# Altium project PCB_Soldeerstation.PrjPcb
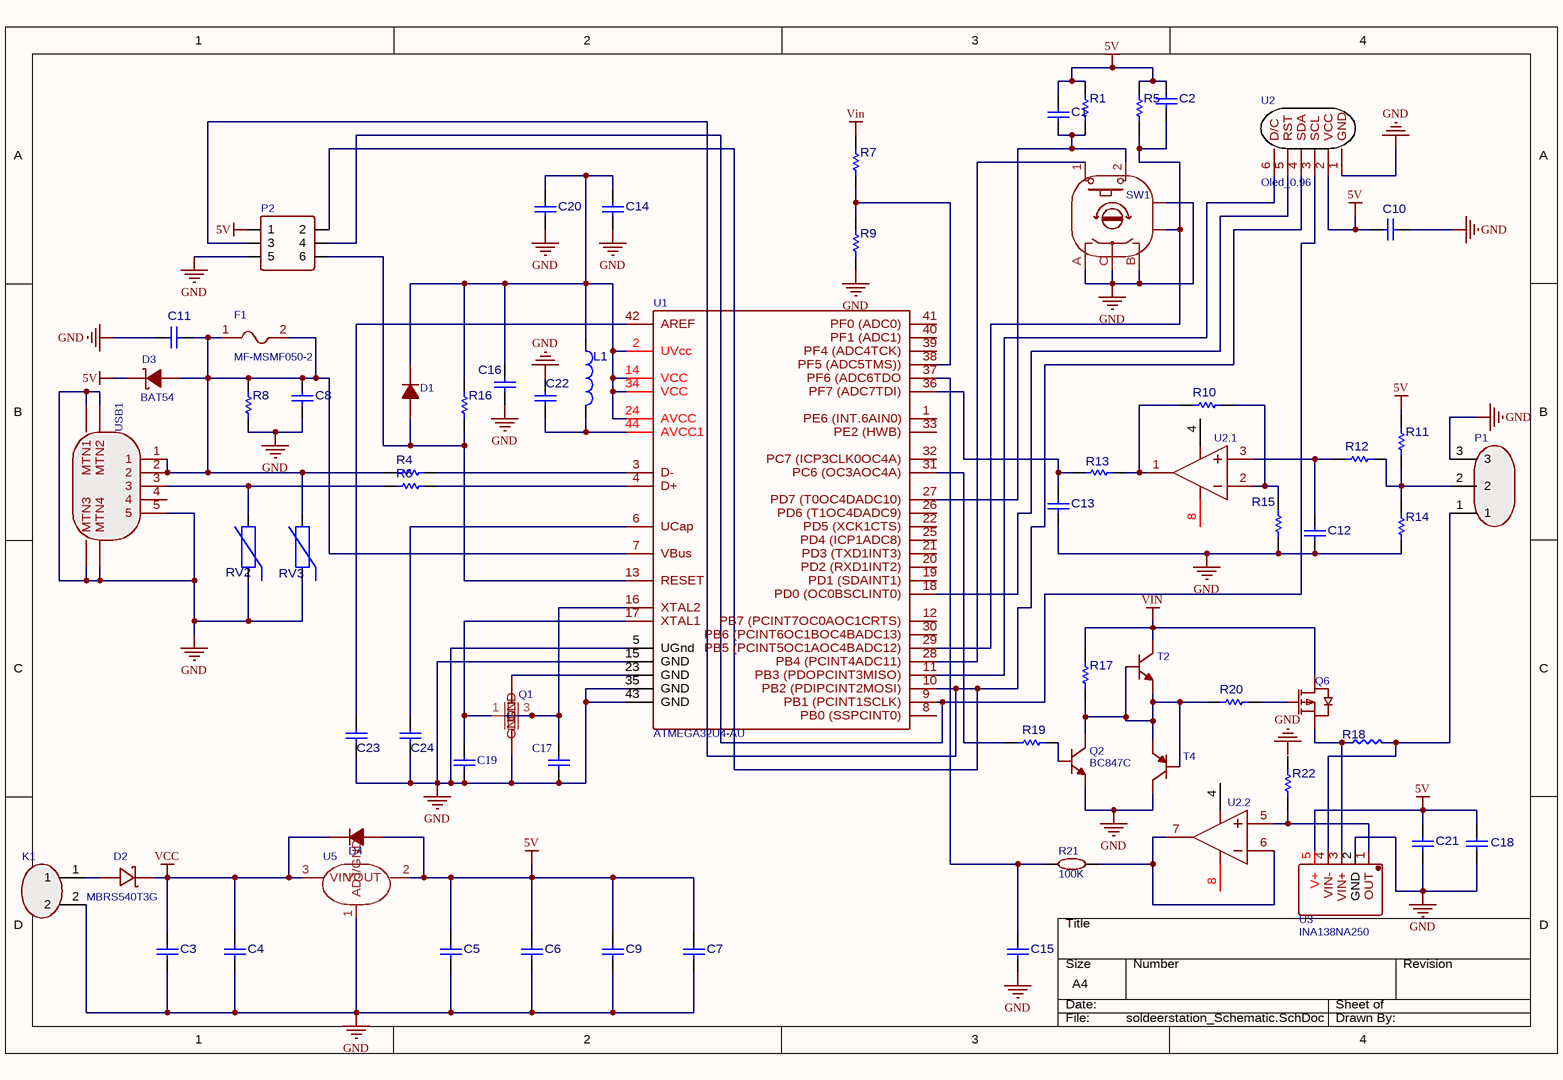
[diagram p0: soldeerstation_Schematic.SchDoc]
1 sheet, 68 parts. Net scope: global (net labels, ports and power ports of the same name join across sheets).
Board file: PCB1.PcbDoc

## Sheet soldeerstation_Schematic.SchDoc: Soldeerstation
size A4; Engineer: Oguzhan Guney

### Parts
*  R18  [r18]
C1  GRM188R71H103KA01D  [CAPC1608X90X35ML10T15]  (value not drawn)
C2  GRM188R71H103KA01D  [CAPC1608X90X35ML10T15]  (value not drawn)
C3  CL31B106KLHNNNE  [CAPC3216X180X50LL20T30]  (value not drawn)
C4  C0402C104K8PACTU  [CAPC1005X60X30ML05T10]  (value not drawn)
C5  C0402C104K8PACTU  [CAPC1005X60X30ML05T10]  (value not drawn)
C6  CAP 47uF 10V 1206(3216)  [CAPC1206(3216)190_N]  (value not drawn)
C7  C1206C106K8RACTU  [CAPC3216X180X50LL20T25]  (value not drawn)
C8  C0402C104K8PACTU  [CAPC1005X60X30ML05T10]  (value not drawn)
C9  C0402C104K8PACTU  [CAPC1005X60X30ML05T10]  (value not drawn)
C10  C0402C104K8PACTU  [CAPC1005X60X30ML05T10]  (value not drawn)
C11  GRM219R61A226MEA0D  [CAPC2013X95X45ML15T25]  (value not drawn)
C12  GRM188R71H103KA01D  [CAPC1608X90X35ML10T15]  (value not drawn)
C13  GRM188R71H103KA01D  [CAPC1608X90X35ML10T15]  (value not drawn)
C14  C0402C104K8PACTU  [CAPC1005X60X30ML05T10]  (value not drawn)
C15  12061C105KAT2A  [CAPC3216X180X50LL20T25]  (value not drawn)
C16  C0402C104K8PACTU  [CAPC1005X60X30ML05T10]  (value not drawn)
C17  CAP 22pF 50V 0805(2012)  [CAPC0805(2012)100_L]  (value not drawn)
C18  C1206C106K8RACTU  [CAPC3216X180X50LL20T25]  (value not drawn)
C19  CAP 22pF 50V 0805(2012)  [CAPC0805(2012)100_L]  (value not drawn)
C20  C1206C106K8RACTU  [CAPC3216X180X50LL20T25]  (value not drawn)
C21  C0402C104K8PACTU  [CAPC1005X60X30ML05T10]  (value not drawn)
C22  12061C105KAT2A  [CAPC3216X180X50LL20T25]  (value not drawn)
C23  C0402C104K8PACTU  [CAPC1005X60X30ML05T10]  (value not drawn)
C24  12061C105KAT2A  [CAPC3216X180X50LL20T25]  (value not drawn)
D1  CD1206-S01575  [D-1206]  (value not drawn)
D2  MBRS540T3G  [SMC]
D3  BAT54  [SOT-23(SOT-23-3)]
D4  S1A  [SMA(DO-214AC)]  (value not drawn)
F1  MF-MSMF050-2  [1812]
K1  WJ25C-B-2P  [WJ25C-B-7.62-2P]  (value not drawn)
L1  74279206  [SMD-0805]  (value not drawn)
P1  WJ25C-B-7.62-3P-13-00A  [WJ25C-B-7.62-3P]  (value not drawn)
P2  Header-Male-2.54_2x3  [HDR-3X2/2.54]  (value not drawn)
Q1  KX-7  [KX-7]  (value not drawn)
Q2  BC847C  [SOT-23(SOT-23-3)]
Q6  IRF9540NPBF  [TO-220(TO-220-3)]  (value not drawn)
R1  RC0603FR-0710KL  [RESC1608X55X25ML10T15]  (value not drawn)
R4  ERJ-2RKF22R0X  [RESC1005X40X25ML05T05]  (value not drawn)
R5  RC0603FR-0710KL  [RESC1608X55X25ML10T15]  (value not drawn)
R6  ERJ-2RKF22R0X  [RESC1005X40X25ML05T05]  (value not drawn)
R7  RC0603FR-0710KL  [RESC1608X55X25ML10T15]  (value not drawn)
R8  RC0603FR-0710KL  [RESC1608X55X25ML10T15]  (value not drawn)
R9  ERJ2RKF2701X  [RESC1005X40X25NL05T05]  (value not drawn)
R10  ERJ2RKF1802X  [RESC1005X40X25NL05T05]  (value not drawn)
R11  ERJ-2RKF1004X  [RESC1005X40X25LL05T05]  (value not drawn)
R12  ERJ2RKF5601X  [RESC1005X40X25LL05T05]  (value not drawn)
R13  ERJ2RKF5601X  [RESC1005X40X25LL05T05]  (value not drawn)
R14  CRCW060310M0FKEA  [RESC1609X50X30ML10T20]  (value not drawn)
R15  91R 1% 0603(1608)  [RESC0603(1608)_L]  (value not drawn)
R16  RC0603FR-0710KL  [RESC1608X55X25ML10T15]  (value not drawn)
R17  ERJ-3EKF4701V  [RESC1608X55X30NL15T15]  (value not drawn)
R19  RC0603FR-0710KL  [RESC1608X55X25ML10T15]  (value not drawn)
R20  91R 1% 0603(1608)  [RESC0603(1608)_L]  (value not drawn)
R21  100K  [0805]
R22  ERJ2RKF5603X  [RESC1005X40X25NL05T05]  (value not drawn)
RV2  CG0603MLC-05E  [BOUR-CG0603-2_V]  (value not drawn)
RV3  CG0603MLC-05E  [BOUR-CG0603-2_V]  (value not drawn)
SW1  PEC11R-4015F-S0024  [BOURNS_PEC11R-4XXXF-SXXXX]  (value not drawn)
T2  BC847C  [SOT-23(SOT-23-3)]  (value not drawn)
T4  BC857C  [SOT-23(SOT-23-3)]  (value not drawn)
U1  ATMEGA32U4-AU  [QFP-44_10X10X08P]
U2  Oled_0.96  [OLED_0.96'']
U2.1  MCP6002T-E/SN  [SOIC-8_150MIL]  (value not drawn)
U2.2  MCP6002T-E/SN  [SOIC-8_150MIL]  (value not drawn)
U3  INA138NA250  [SOT-23-5]
U5  NCP1117ST50T3G  [SOT-223]  (value not drawn)
USB1  micro USB_B Female  [MICRO-USB-1]  (value not drawn)

### Nets
5V: C1.2 C2.2 C5.2 C6.2 C7.2 C9.2 C10.2 C18.2 C21.2 D3.3(K) D4.1(A) P2.1 R1.2 R5.2 R11.2 U2.2(VCC) U3.5(V+) U5.2(VOUT)
GND: C3.1 C4.1 C5.1 C6.1 C7.1 C8.1 C9.1 C10.1 C11.1 C12.1 C13.1 C14.1 C15.1 C16.1 C17.1 C18.1 C19.1 C20.1 C21.1 C22.2 C23.1 C24.1 K1.2 P1.3 P2.5 Q1.2(GND) Q2.2(E) R8.1 R9.1 R14.1 R15.2 RV2.1 RV3.1 SW1.A SW1.B SW1.C SW1.MT2 T4.3(C) U1.5(UGnd) U1.15(GND) U1.35(GND) U1.43(GND) U2.1(GND) U3.2(GND) U5.1(ADJ/GND) USB1.0(MTN4) USB1.5
VCC: C3.2 C4.2 D2.C D4.2(K) U5.3(VIN)
Vin: Q6.2(D) R7.2 R17.2 T2.3(C)
Net*_2: *.2 Q6.3(S) U3.3(VIN+)
Net*_3: *.3 P1.1 U3.4(VIN-)
NetC1_1: C1.1 R1.1 SW1.2 U1.27(PD7_(T0OC4DADC10))
NetC2_1: C2.1 R5.1 SW1.MT1 U1.29(PB5_(PCINT5OC1AOC4BADC12))
NetC8_2: C8.2 C11.2 D3.1(A) F1.1 F1.2 R4.1 R8.2 RV3.2 U1.7(VBus) USB1.1 USB1.2
NetC12_2: C12.2 R12.1 U2.1.3(VINA+)
NetC13_2: C13.2 R13.1 U1.36(PF7_(ADC7TDI))
NetC14_2: C14.2 C16.2 C20.2 D1.2(K) L1.1 R16.2 U1.2(UVcc) U1.14(VCC) U1.24(AVCC) U1.34(VCC)
NetC15_2: C15.2 R21.1 U1.37(PF6_(ADC6TDO)
NetC17_2: C17.2 Q1.3 U1.16(XTAL2)
NetC19_2: C19.2 Q1.1 U1.17(XTAL1)
NetC22_1: C22.1 L1.2 U1.44(AVCC1)
NetC23_2: C23.2 U1.42(AREF)
NetC24_2: C24.2 U1.6(UCap)
NetD1_1: D1.1(A) P2.6 R16.1 U1.13(RESET)
NetD2_A: D2.A K1.1
NetP1_2: P1.2 R11.1 R12.2 R14.2
NetP2_2: P2.2 P2.3 U1.10(PB2_(PDIPCINT2MOSI)) U2.4(SDA)
NetP2_4: P2.4 U1.9(PB1_(PCINT1SCLK)) U2.3(SCL)
NetQ1_4: Q1.4(GND) U1.23(GND)
NetQ2_1: Q2.1(B) R19.2
NetQ2_3: Q2.3(C) R17.1 R20.1 T2.1(B) T2.2(E) T4.1(B) T4.2(E)
NetQ6_1: Q6.1(G) R20.2
NetR4_2: R4.2 U1.3(D-)
NetR6_1: R6.1 RV2.2 USB1.3
NetR6_2: R6.2 U1.4(D+)
NetR7_1: R7.1 R9.2 U1.38(PF5_(ADC5TMS)))
NetR10_1: R10.1 R13.2 U2.1.1(VOUTA)
NetR10_2: R10.2 R15.1 U2.1.2(VINA-)
NetR19_1: R19.1 U1.31(PC6_(OC3AOC4A))
NetR21_2: R21.2 U2.2.6(VINB-) U2.2.7(VOUTB)
NetR22_2: R22.2 U2.2.5(VINB+) U3.1(OUT)
NetSW1_1: SW1.1 U1.28(PB4_(PCINT4ADC11))
NetU1_11: U1.11(PB3_(PDOPCINT3MISO)) U2.6(D/C)
NetU1_18: U1.18(PD0_(OC0BSCLINT0)) U2.5(RST)

Not connected (* = marked no-connect by the designer): R22 1; U1 1(PE6_(INT.6AIN0)) 8(PB0_(SSPCINT0)) 12(PB7_(PCINT7OC0AOC1CRTS)) 19(PD1_(SDAINT1)) 20(PD2_(RXD1INT2)) 21(PD3_(TXD1INT3)) 22(PD5_(XCK1CTS)) 25(PD4_(ICP1ADC8)) 26(PD6_(T1OC4DADC9)) 30(PB6_(PCINT6OC1BOC4BADC13)) 32(PC7_(ICP3CLK0OC4A)) 33(PE2_(HWB)) 39(PF4_(ADC4TCK)) 40(PF1_(ADC1)) 41(PF0_(ADC0)); U2.1 4(VSS) 8(VDD); U2.2 4(VSS) 8(VDD); USB1 4

### Notes on the sheet
- Labels drawn without touching a wire or pin: GND

### Library data of the parts
* = RESISTOR18: Supplier 1: Digi-Key; Supplier Part Number 1: MCS3264R020FERCT-ND
C1 C2 C12 C13 = CMP-2100-03642-1: Chip Capacitor, 10 nF, +/- 10%, 50 V, -55 to 125 degC, 0603 (1608 Metric), RoHS, Tape and Reel; Manufacturer: Murata; Insulation Resistance: 10GR; Dielectric: X7R; Voltage Rating: 50V; Capacitance: 10nF; Material: Ceramic; Package Quantity: 1; Lead Free: LeadFree; Case/Package: 0603; Termination: SMD/SMT; REACH SVHC: Unknown; Manufacturer URL: http://www.murata.com/; Datasheet URL: http://search.murata.co.jp/Ceramy/image/img/A01X/G101/ENG/GRM188R71H103KA01-01.pdf; Mount: SurfaceMount; Datasheet Version: 42401.0; Number of Pins: 2; Length: 1.6mm; Voltage: 50V; Depth: 0.8mm; Tolerance: 10%; Min Operating Temperature: -55degC; Voltage Rating (DC): 50V; Max Operating Temperature: 125degC; Package Description: 2-Pin Surface Mount Device, Body 1.6 x 0.8 mm; RoHSCompliant: True; Case Code (Imperial): 0603; Width: 0.031inch; Case Code (Metric): 1608; Height: 0.8mm; Package Reference: 0603; Packaging: TapeandReel; Thickness: 0.035inch; Dielectric Material: Ceramic
C3 = CMP-2000-06108-1: Chip Capacitor, 10 uF, +/- 10%, 35 V, -55 to 125 degC, 1206 (3216 Metric), RoHS, Tape and Reel; Manufacturer: Samsung Electro-Mechanics; Material properties: X7R; Capacity (elec.): 10µF; Nominal voltage: 35V; Content: 2000pc(s); Material: Ceramic; Type: 1206; Industrial packaging: Yes; Mounting Technology: SurfaceMount; Package Reference: 1206; Manufacturer URL: http://www.samsungsem.com/global/index.jsp; Datasheet URL: http://www.samsungsem.com/kr/support/product-search/mlcc/__icsFiles/afieldfile/2016/08/18/S_CL31B106KLHNNNE.pdf; Package Description: 2-Pin Surface Mount Device, Body 3.2 x 1.6 mm; Datasheet Version: 07/2016; Packaging type: Reel; Category: Ceramiccapacitor; Tolerance: 10%
C4 C5 C8-C10 C14 C16 C21 C23 = CMP-2008-02046-1: Manufacturer: Kemet; Part Number: C0402C104K8PACTU
C6 = CMP-1037-05002-1: CAP 47uF 10V ±20% 1206 (3216 Metric) Thickness 1.9mm SMD; Case-Metric: 3216; Case-EIA: 1206; Tolerance: Â±20%; Technology: SMT; Rated Voltage: 10 V; Value: 47uF; Max Thickness: 1.9 mm
C7 C18 C20 = CMP-2000-06013-1: Chip Capacitor, 10 uF, +/- 10%, 10 V, -55 to 125 degC, 1206 (3216 Metric), RoHS, Tape and Reel; Type: SMDMLCCX7R6.3-250VDCCommericalGrade; Class: Class1; Case Height: 1.6mm; Temperature Coefficient / Code: +/-15%; Capacitance: 10uF; Brand: Kemet; Case Length: 3.2mm; Dissipation Factor DF: 5; Voltage Rating: 10V; Dielectric: X7R; Tolerance: 10%; Package Reference: 1206; Dimensions: 1.6mmWx3.2mmLx1.6mmH; Series: C1206C; Minimum Operating Temperature: -55C; RoHS: Details; Termination Style: SMD/SMT; Mounting Technology: SurfaceMount; Manufacturer: Kemet; Product Category: MultilayerCeramicCapacitorsMLCC-SMD/SMT; Case Code - mm: 3216; Manufacturer URL: http://www.kemet.com/; Product: GeneralTypeMLCCs; Package Description: 2-Pin Surface Mount Device, Body 3.2 x 1.6 mm; Case Width: 1.6mm; Factory Pack Quantity: 2000; Package / Case: 1206(3216metric); Datasheet URL: http://www.kemet.com/docfinder?Partnumber=C1206C106K8RACTU; Datasheet Version: 02/2016; Operating Temperature Range: -55Cto+125C; Voltage Rating DC: 10V; Case Code - in: 1206; Maximum Operating Temperature: +125C; Packaging: Reel
C11 = CMP-2007-00096-1: Manufacturer: Murata; Part Number: GRM219R61A226MEA0D
C15 C22 C24 = CMP-2000-05861-1: Chip Capacitor, 1 uF, +/- 10%, 100 V, -55 to 125 degC, 1206 (3216 Metric), RoHS, Tape and Reel; Manufacturer: AVX; Capacitance: 1µF; Dielectric: X7R; Rated Voltage: 100V; Mounting Technology: SurfaceMount; Package Description: 2-Pin Surface Mount Device, Body 3.2 x 1.6 mm; Case Size/Dimension: 1206; Datasheet Version: 07/2016; Manufacturer URL: http://www.avx.com/; Package Reference: 1206; Datasheet URL: http://datasheets.avx.com/X7RDielectric.pdf; Tolerance (%): ±10%
C17 C19 = CMP-1036-01245-1: CAP 22pF 50V ±10% 0805 (2012 Metric) Thickness 1mm SMD; Tolerance: Â±10%; Case-EIA: 0805; Case-Metric: 2012; Rated Voltage: 50 V; Technology: SMT; Value: 22pF; Max Thickness: 1 mm
D1 = CD1206-S01575: BOM_Manufacturer: BOURNS; Contributor: LCSC; BOM_Supplier: LCSC; BOM_Supplier Part: C75465; BOM_Manufacturer Part: CD1206-S01575; spicePre: D
D2 = MBRS540T3G: Manufacturer: ON Semiconductor; nameAlias: Model; Contributor: elnarte; spicePre: D; BOM_Manufacturer Part: ?; spiceSymbolName: MBRS540T3G
D3 = BAT54: BOM_Manufacturer: Hottech; Contributor: LCSC; BOM_Supplier: LCSC; BOM_Manufacturer Part: BAT54; BOM_Supplier Part: C181198; spicePre: D
D4 = S1A: BOM_Manufacturer: MDD; BOM_Supplier: LCSC; BOM_Manufacturer Part: S1A; image: //image.lceda.cn/szlcsc/C64912.jpg; BOM_Supplier Part: C64912; spicePre: D
F1 = MF-MSMF050-2: BOM_Manufacturer: BOURNS; BOM_Supplier: LCSC; BOM_Manufacturer Part: MF-MSMF050-2; BOM_Supplier Part: C17313; spicePre: U
K1 = WJ25C-B-2P: BOM_Manufacturer: ReliaPro; BOM_Supplier: LCSC; BOM_Manufacturer Part: WJ25C-B-2P; image: //image.lceda.cn/szlcsc/C8422.jpg; BOM_Supplier Part: C8422; spicePre: P
L1 = CMP-0220-00038-1: SMD EMI Suppression Ferrite Bead WE-CBF, Z = 30 Ohm; Impedance: 30 Ohm; PackageDescription: Chip Inductor, 2-Leads, Body 2.0 x 1.2 mm; ComponentLink1Description: Manufacturer Link; PackageReference: SMD-0805; ComponentLink2Description: Datasheet; PackageVersion: 2005; ComponentLink1URL: http://www.we-online.com; ComponentLink2URL: http://www.we-online.de/katalog/media/pdf/74279206.pdf; DatasheetVersion: Dec-2005
P1 = WJ25C-B-7.62-3P-13-00A: BOM_Manufacturer: ReliaPro; BOM_Supplier: LCSC; BOM_Manufacturer Part: WJ25C-B-7.62-3P-13-00A; image: //image.lceda.cn/szlcsc/C61583.jpg; BOM_Supplier Part: C61583; spicePre: P
P2 = Header-Male-2.54_2x3: BOM_Manufacturer: BOOMELE; BOM_Supplier: LCSC; BOM_Manufacturer Part: Header-Male-2.54_2x3; BOM_Supplier Part: C65114; spicePre: P
Q1 = KX-7: BOM_Manufacturer Part: GEYER 32MHz 10/10; Contributor: bazis.ural; spicePre: Q
Q2 T2 = BC847C: BOM_Manufacturer: Hottech; Contributor: LCSC; BOM_Supplier: LCSC; BOM_Manufacturer Part: BC847C; BOM_Supplier Part: C181141; spicePre: Q
Q6 = IRF9540NPBF: BOM_Manufacturer: IR; BOM_Supplier: LCSC; BOM_Manufacturer Part: IRF9540NPBF; image: //image.lceda.cn/szlcsc/C2575.jpg; BOM_Supplier Part: C2575; spicePre: Q
R1 R5 R7 R8 R16 R19 = CMP-2100-03664-1: Chip Resistor, 10 KOhm, +/- 1%, 01 W, -55 to 155 degC, 0603 (1608 Metric), RoHS, Tape and Reel; Manufacturer: Yageo; Temperature Coefficient: 100ppm/degreesC; Resistance: 10KOhm; Voltage Rating: 75V; Power Rating: 100mW; Voltage Rating (DC): 50V; Composition: ThickFilm; RoHSCompliant: true; Height: 0.45mm; Lead Free: LeadFree; Case Code (Metric): 1608; Case/Package: 0603; Datasheet Version: Rev. 5, 10/2016; Package Reference: 0603; Depth: 0.8mm; Package Description: 2-Pin Surface Mount Device, Body 1.6 x 0.8 mm; Case Code (Imperial): 0603; Packaging: TapeandReel; Termination: SMD/SMT; Lead Pitch: 0.3mm; Width: 0.8mm; Number of Pins: 2; Length: 1.6mm; REACH SVHC: NoSVHC; Military Standard: Not; Max Operating Temperature: 155degC; Min Operating Temperature: -55degC; Manufacturer URL: http://www.yageo.com/; Datasheet URL: http://www.yageo.com/NewPortal/yageodocoutput?fileName=/pdf/R-Chip/PYu-RC_Group_51_RoHS_L_5.pdf; Weight: 7.1E-05oz; Tolerance: 1%
R4 R6 = CMP-1665-00027-3: Chip Resistor, 22 Ohm, +/- 1%, 0.1 W, -55 to 155 degC, 0402 (1005 Metric), RoHS, Tape and Reel; Case\/Package: 0402; Resistance: 22 Ohm; Power Rating: 100 mW; Voltage Rating: 50 V; ComponentLink2Description: Datasheet; PartNumber: ERJ-2RKF22R0X; Packaging: Tape and Reel; Weight: 2.8E-05oz; Pins: 2; Case Code (Imperial): 0402; Width: 0.5 mm; ComponentLink2URL: http://industrial.panasonic.com/cdbs/www-data/pdf/RDA0000/AOA0000C86.pdf; Height: 0.35 mm; PackageReference: 0402; REACH SVHC: Yes; Min Operating Temperature: -55 degC; Length: 1 mm; DatasheetVersion: 04/2015; RoHSCompliant: true; Package Quantity: 10000; Case Code (Metric): 1005; PackageDescription: 2-Pin Surface Mount Device, Body 1 x 0.5 mm; ComponentLink1URL: http://www.panasonic.com/; Mount: Surface Mount; Mounting Technology: Surface Mount; Tolerance: 1%; Max Operating Temperature: 155 degC; ComponentLink1Description: Manufacturer URL
R9 = CMP-2002-01138-1: Manufacturer: Panasonic; Part Number: ERJ2RKF2701X
R10 = CMP-2002-01129-1: Manufacturer: Panasonic; Part Number: ERJ2RKF1802X
R11 = CMP-2002-00609-3: Chip Resistor, 1 MOhm, +/- 1%, 100 mW, -55 to 155 degC, 0402 (1005 Metric), RoHS, Tape and Reel; Manufacturer: Basic Passives; Voltage Rating: 50 V; Case\/Package: 0402; Resistance: 1 MOhm; Power Rating: 100 mW; Pins: 2; Max Operating Temperature: 155 degC; ComponentLink2URL: http://industrial.panasonic.com/cdbs/www-data/pdf/RDA0000/AOA0000C86.pdf; Weight: 2.8E-05oz; ComponentLink1URL: http://www.panasonic.com/; Radiation Hardening: No; Height: 0.35 mm; Case Code (Imperial): 0402; ComponentLink2Description: Datasheet; Mount: Surface Mount; ComponentLink1Description: Manufacturer URL; REACH SVHC: Yes; PartNumber: ERJ-2RKF1004X; Length: 1 mm; Min Operating Temperature: -55 degC; Width: 0.5 mm; Package Quantity: 10000; Tolerance: 1%; PackageDescription: 2-Pin Surface Mount Device, Body 1 x 0.5 mm; RoHSCompliant: true; DatasheetVersion: 04/2015; PackageReference: 0402; Mounting Technology: Surface Mount; Case Code (Metric): 1005; Packaging: Tape and Reel
R12 R13 = CMP-2002-01160-1: Manufacturer: Panasonic; Part Number: ERJ2RKF5601X
R14 = CMP-2000-03843-1: Manufacturer: Vishay Dale; Part Number: CRCW060310M0FKEA
R15 R20 = CMP-1012-00393-1: 91R 0.1W 1% 0603 (1608 Metric)  SMD; Case-Metric: 1608; Case-EIA: 0603; Value: 91.00 Ohm; Technology: SMT; Power: 0.1 W; Tolerance: 1 %
R17 = CMP-1665-00059-1: Precision Thick Film Chip Resistor, 4.7 KOhm, +/- 1%, -55 to 155 degC, 0603 (1608 Metric), RoHS, Tape and Reel; Resistance: 220 Ohm; Voltage Rating: 50 V; Elements: 4; Case\Package: 1205; Tolerance: 5%; Power Rating: 250 mW; PackageReference: 0603; Max Operating Temperature: 125 degC; REACH SVHC: No SVHC; Width: 0.063 inch; Length: 0.126 inch; Height: 0.024 inch; Mount: Surface Mount; Package Quantity: 1; DatasheetVersion: Apr-15; ComponentLink1Description: Manufacturer URL; Min Operating Temperature: -55 degC; Packaging: Tape and Reel; Radiation Hardening: No; ComponentLink2URL: http://industrial.panasonic.com/cdbs/www-data/pdf/RDA0000/AOA0000C86.pdf; Case Code (Metric): 3216; Pins: 8; Case Code (Imperial): 1206; Type (Resistor): Thick Film; RoHSCompliant: true; ComponentLink2Description: Datasheet; PackageDescription: 2-Pin Surface Mount Device, Body 1.6 x 0.85 mm; ComponentLink1URL: http://www.panasonic.com/
R21 = 100K: BOM_Manufacturer Part: TC0525F1003T5E; BOM_Manufacturer: UniOhm; nameAlias: Resistance (Ohms); BOM_Supplier: LCSC; BOM_Supplier Part: C57246; spicePre: R; spiceSymbolName: TC0525F1003T5E
R22 = CMP-2002-01162-1: Manufacturer: Panasonic; Part Number: ERJ2RKF5603X
RV2 RV3 = CMP-0584-00001-2: ESD Protector, 5 V Supply, -40 to 85 degC, 1.6 x 0.8 x 0.55 mm SMD, RoHS, Tape and Reel; Manufacturer: Bourns; VC: 20 V; VT: 150 V; RT: 1 ns; VDC: 5 V; CO: 0.5 pF; PartNumber: CG0603MLC-05E; ComponentLink1Description: Manufacturer URL; ComponentLink1URL: http://www.bourns.com/; Packing: Tape and Reel; Mounting Technology: Surface Mount; ComponentLink2Description: Datasheet; RoHS: TRUE; Operating Temperature: -40 to 85 degC; DatasheetVersion: Rev. S; PackageDescription: 2-Pin SMD, Body 1.6 x 0.8 mm, Pitch 1.52 mm; PackageReference: CG0603-2; ComponentLink2URL: http://www.bourns.com/data/global/pdfs/MLC.pdf
SW1 = PEC11R-4015F-S0024: BOM_Manufacturer: BOURNS; Contributor: LCSC; BOM_Supplier: LCSC; BOM_Supplier Part: C143789; BOM_Manufacturer Part: PEC11R-4015F-S0024; spicePre: S
T4 = BC857C: BOM_Manufacturer: Hottech; Contributor: LCSC; BOM_Supplier: LCSC; BOM_Manufacturer Part: BC857C; BOM_Supplier Part: C181147; spicePre: Q
U1 = ATMEGA32U4-AU: BOM_Manufacturer: MICROCHIP; BOM_Supplier: LCSC; BOM_Manufacturer Part: ATMEGA32U4-AU; image: //image.lceda.cn/szlcsc/C44854.jpg; BOM_Supplier Part: C44854; spicePre: U
U2 = Oled_0.96: Contributor: Ivan K; BOM_Manufacturer Part: Oled_0.96''; spicePre: U
U2.1 = MCP6002T-E/SN_1: BOM_Manufacturer: MICROCHIP; subpart_no: 2; BOM_Supplier Part: C125816; BOM_Supplier: LCSC; BOM_Manufacturer Part: MCP6002T-E/SN; Operating Temperature: -40¡ãC ~ 125¡ãC; spicePre: U
U2.2 = MCP6002T-E/SN: BOM_Manufacturer: MICROCHIP; subpart_no: 1; BOM_Supplier Part: C125816; BOM_Supplier: LCSC; BOM_Manufacturer Part: MCP6002T-E/SN; Operating Temperature: -40¡ãC ~ 125¡ãC; spicePre: U
U3 = INA138NA250: BOM_Manufacturer: TI; Contributor: LCSC; BOM_Supplier: LCSC; BOM_Manufacturer Part: INA138NA250; BOM_Supplier Part: C133804; spicePre: U
U5 = NCP1117ST50T3G: BOM_Manufacturer: ON; timeStamp: 1466353290; BOM_Supplier: LCSC; BOM_Manufacturer Part: NCP1117ST50T3G; image: //image.lceda.cn/szlcsc/C17314.jpg; BOM_Supplier Part: C17314; spicePre: U
USB1 = micro USB_B Female: BOM_Manufacturer: ValuePro; BOM_Manufacturer Part: micro USBFemale; BOM_Supplier: LCSC; image: //image.lceda.cn/szlcsc/C10418.jpg; BOM_Supplier Part: C10418; spicePre: U